# Altium schematic sheet passive_balancing.SchDoc: foxBMS BMS-Slave 12-Cell
size 350 x 299 mm; DocumentNumber: 9; SheetNumber: 9; SheetTotal: 21; AUTHOR: Fraunhofer IISB foxBMS Team; SheetDescription: Passive Cell Balancing
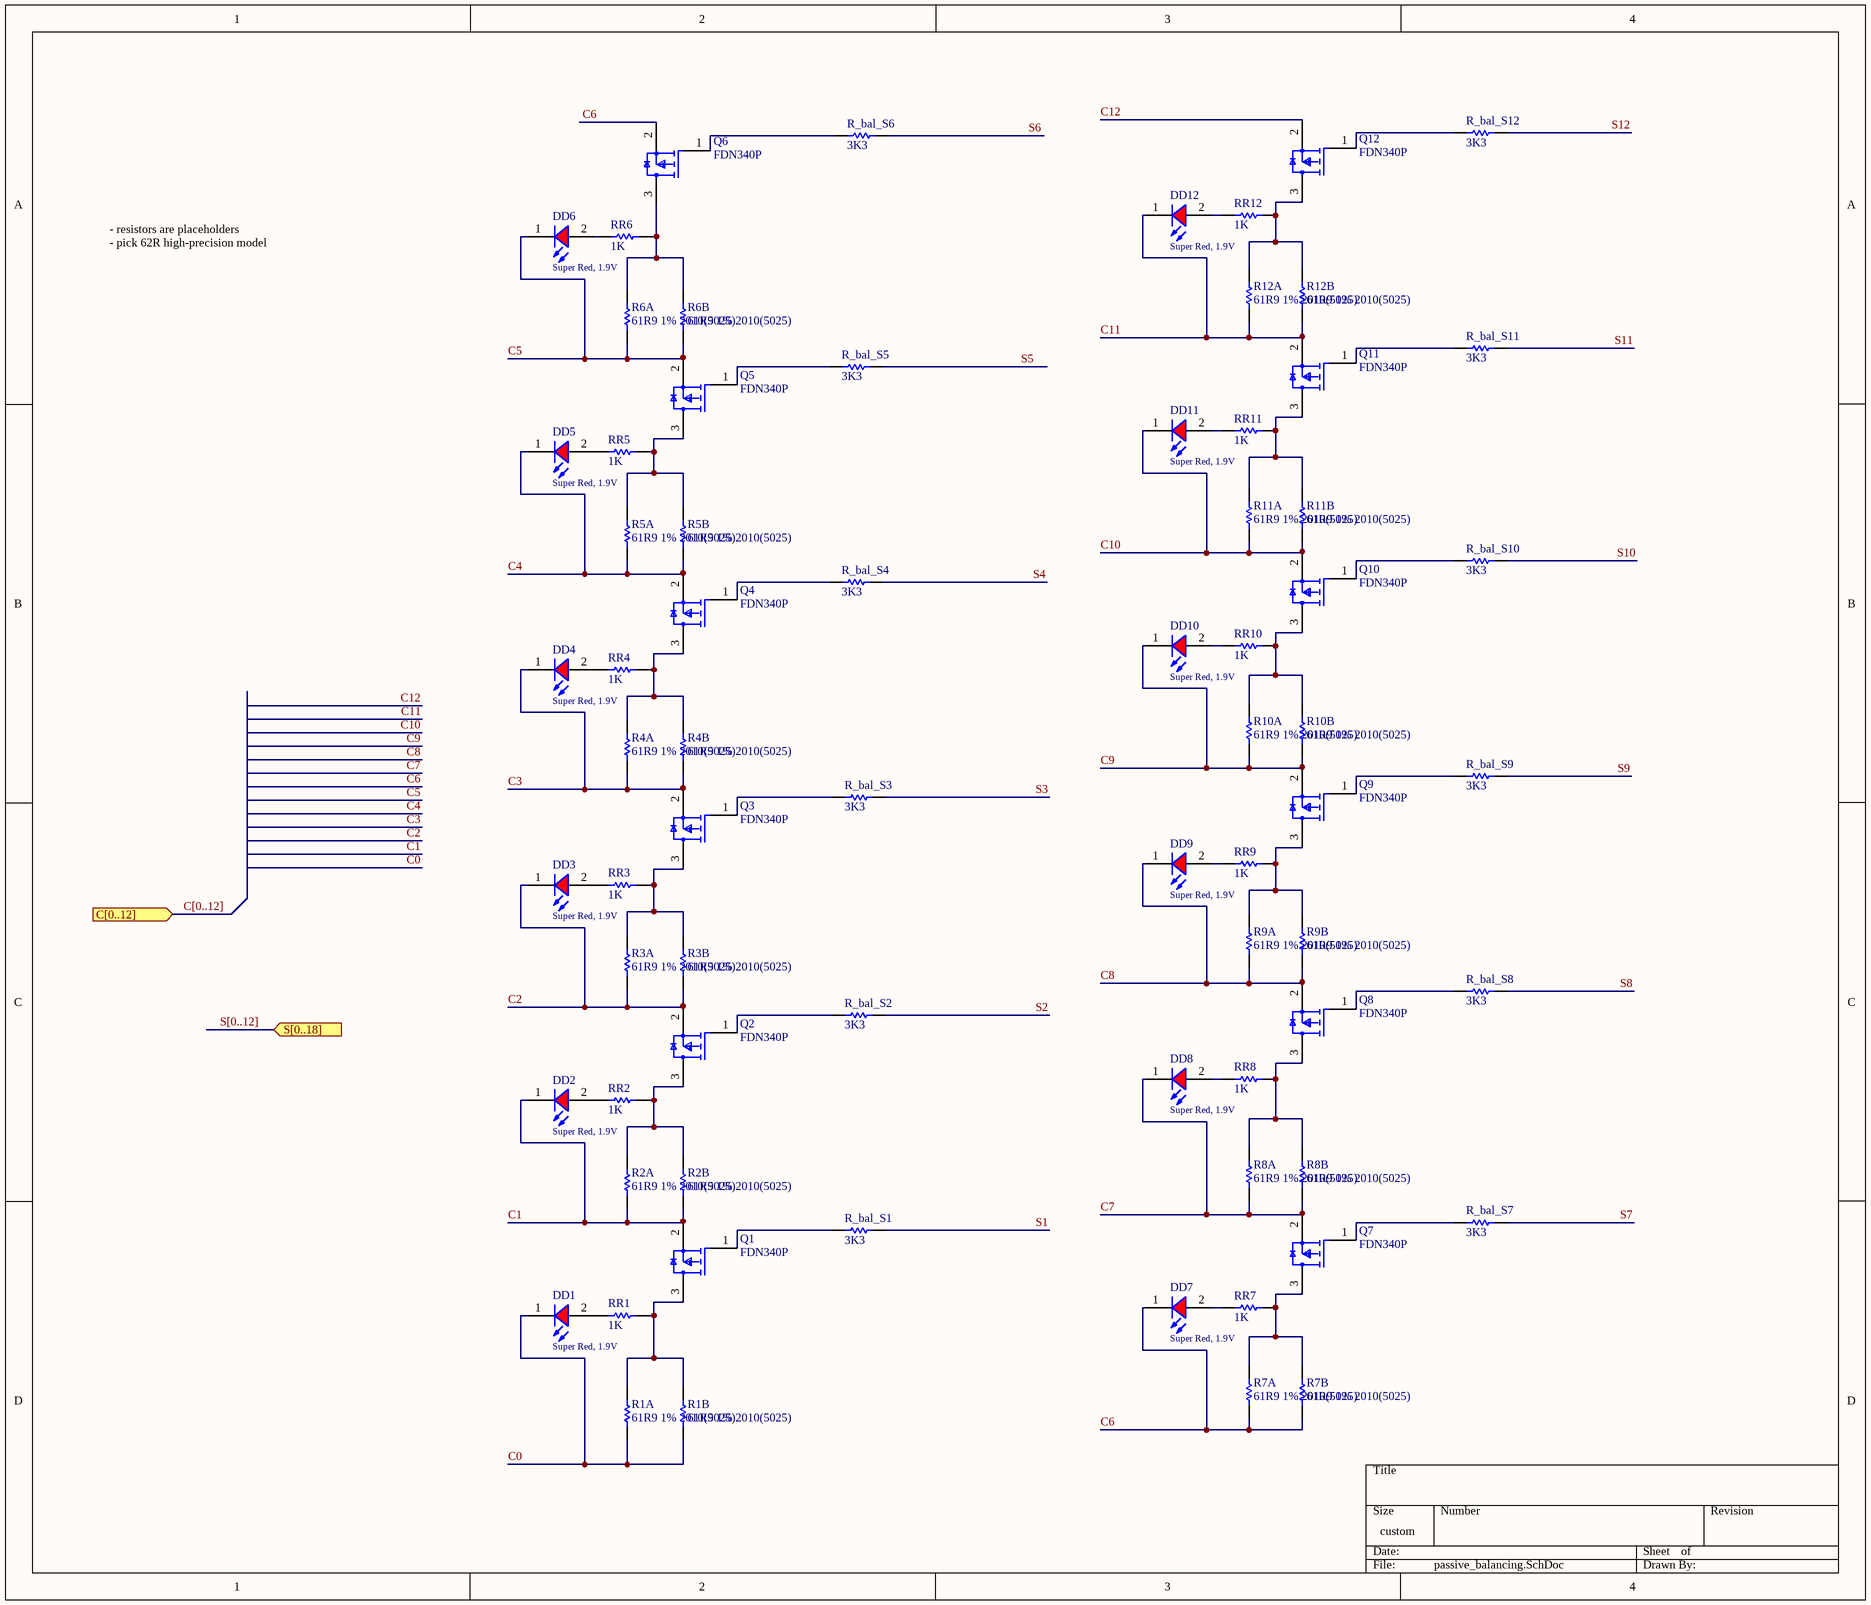
[diagram p0: passive_balancing.SchDoc]

## Parts
DD1  Super Red, 1.9V  [WL-SMCW_0603_H=0.7mm]
DD2  Super Red, 1.9V  [WL-SMCW_0603_H=0.7mm]
DD3  Super Red, 1.9V  [WL-SMCW_0603_H=0.7mm]
DD4  Super Red, 1.9V  [WL-SMCW_0603_H=0.7mm]
DD5  Super Red, 1.9V  [WL-SMCW_0603_H=0.7mm]
DD6  Super Red, 1.9V  [WL-SMCW_0603_H=0.7mm]
DD7  Super Red, 1.9V  [WL-SMCW_0603_H=0.7mm]
DD8  Super Red, 1.9V  [WL-SMCW_0603_H=0.7mm]
DD9  Super Red, 1.9V  [WL-SMCW_0603_H=0.7mm]
DD10  Super Red, 1.9V  [WL-SMCW_0603_H=0.7mm]
DD11  Super Red, 1.9V  [WL-SMCW_0603_H=0.7mm]
DD12  Super Red, 1.9V  [WL-SMCW_0603_H=0.7mm]
Q1  FDN340P  [FP-527AG-MFG]
Q2  FDN340P  [FP-527AG-MFG]
Q3  FDN340P  [FP-527AG-MFG]
Q4  FDN340P  [FP-527AG-MFG]
Q5  FDN340P  [FP-527AG-MFG]
Q6  FDN340P  [FP-527AG-MFG]
Q7  FDN340P  [FP-527AG-MFG]
Q8  FDN340P  [FP-527AG-MFG]
Q9  FDN340P  [FP-527AG-MFG]
Q10  FDN340P  [FP-527AG-MFG]
Q11  FDN340P  [FP-527AG-MFG]
Q12  FDN340P  [FP-527AG-MFG]
R1A  61R9 1% 2010(5025)  [RESC2010(5025)_M]
R1B  61R9 1% 2010(5025)  [RESC2010(5025)_M]
R2A  61R9 1% 2010(5025)  [RESC2010(5025)_M]
R2B  61R9 1% 2010(5025)  [RESC2010(5025)_M]
R3A  61R9 1% 2010(5025)  [RESC2010(5025)_M]
R3B  61R9 1% 2010(5025)  [RESC2010(5025)_M]
R4A  61R9 1% 2010(5025)  [RESC2010(5025)_M]
R4B  61R9 1% 2010(5025)  [RESC2010(5025)_M]
R5A  61R9 1% 2010(5025)  [RESC2010(5025)_M]
R5B  61R9 1% 2010(5025)  [RESC2010(5025)_M]
R6A  61R9 1% 2010(5025)  [RESC2010(5025)_M]
R6B  61R9 1% 2010(5025)  [RESC2010(5025)_M]
R7A  61R9 1% 2010(5025)  [RESC2010(5025)_M]
R7B  61R9 1% 2010(5025)  [RESC2010(5025)_M]
R8A  61R9 1% 2010(5025)  [RESC2010(5025)_M]
R8B  61R9 1% 2010(5025)  [RESC2010(5025)_M]
R9A  61R9 1% 2010(5025)  [RESC2010(5025)_M]
R9B  61R9 1% 2010(5025)  [RESC2010(5025)_M]
R10A  61R9 1% 2010(5025)  [RESC2010(5025)_M]
R10B  61R9 1% 2010(5025)  [RESC2010(5025)_M]
R11A  61R9 1% 2010(5025)  [RESC2010(5025)_M]
R11B  61R9 1% 2010(5025)  [RESC2010(5025)_M]
R12A  61R9 1% 2010(5025)  [RESC2010(5025)_M]
R12B  61R9 1% 2010(5025)  [RESC2010(5025)_M]
R_bal_S1  3K3  [RESC0603(1608)_N]
R_bal_S2  3K3  [RESC0603(1608)_N]
R_bal_S3  3K3  [RESC0603(1608)_N]
R_bal_S4  3K3  [RESC0603(1608)_N]
R_bal_S5  3K3  [RESC0603(1608)_N]
R_bal_S6  3K3  [RESC0603(1608)_N]
R_bal_S7  3K3  [RESC0603(1608)_N]
R_bal_S8  3K3  [RESC0603(1608)_N]
R_bal_S9  3K3  [RESC0603(1608)_N]
R_bal_S10  3K3  [RESC0603(1608)_N]
R_bal_S11  3K3  [RESC0603(1608)_N]
R_bal_S12  3K3  [RESC0603(1608)_N]
RR1  1K  [RESC0603(1608)_N]
RR2  1K  [RESC0603(1608)_N]
RR3  1K  [RESC0603(1608)_N]
RR4  1K  [RESC0603(1608)_N]
RR5  1K  [RESC0603(1608)_N]
RR6  1K  [RESC0603(1608)_N]
RR7  1K  [RESC0603(1608)_N]
RR8  1K  [RESC0603(1608)_N]
RR9  1K  [RESC0603(1608)_N]
RR10  1K  [RESC0603(1608)_N]
RR11  1K  [RESC0603(1608)_N]
RR12  1K  [RESC0603(1608)_N]

## Ports
C[0..12] (in), S[0..18] (in)

## Nets
C0: DD1.1(K) R1A.1 R1B.1
C1: DD2.1(K) Q1.2(S) R2A.1 R2B.1
C2: DD3.1(K) Q2.2(S) R3A.1 R3B.1
C3: DD4.1(K) Q3.2(S) R4A.1 R4B.1
C4: DD5.1(K) Q4.2(S) R5A.1 R5B.1
C5: DD6.1(K) Q5.2(S) R6A.1 R6B.1
C6: DD7.1(K) Q6.2(S) R7A.1 R7B.1
C7: DD8.1(K) Q7.2(S) R8A.1 R8B.1
C8: DD9.1(K) Q8.2(S) R9A.1 R9B.1
C9: DD10.1(K) Q9.2(S) R10A.1 R10B.1
C10: DD11.1(K) Q10.2(S) R11A.1 R11B.1
C11: DD12.1(K) Q11.2(S) R12A.1 R12B.1
C12: Q12.2(S)
S1: R_bal_S1.2
S2: R_bal_S2.2
S3: R_bal_S3.2
S4: R_bal_S4.2
S5: R_bal_S5.2
S6: R_bal_S6.2
S7: R_bal_S7.2
S8: R_bal_S8.2
S9: R_bal_S9.2
S10: R_bal_S10.2
S11: R_bal_S11.2
S12: R_bal_S12.2
NetDD1_2: DD1.2(A) RR1.2
NetDD2_2: DD2.2(A) RR2.2
NetDD3_2: DD3.2(A) RR3.2
NetDD4_2: DD4.2(A) RR4.2
NetDD5_2: DD5.2(A) RR5.2
NetDD6_2: DD6.2(A) RR6.2
NetDD7_2: DD7.2(A) RR7.2
NetDD8_2: DD8.2(A) RR8.2
NetDD9_2: DD9.2(A) RR9.2
NetDD10_2: DD10.2(A) RR10.2
NetDD11_2: DD11.2(A) RR11.2
NetDD12_2: DD12.2(A) RR12.2
NetQ1_1: Q1.1(G) R_bal_S1.1
NetQ1_3: Q1.3(D) R1A.2 R1B.2 RR1.1
NetQ2_1: Q2.1(G) R_bal_S2.1
NetQ2_3: Q2.3(D) R2A.2 R2B.2 RR2.1
NetQ3_1: Q3.1(G) R_bal_S3.1
NetQ3_3: Q3.3(D) R3A.2 R3B.2 RR3.1
NetQ4_1: Q4.1(G) R_bal_S4.1
NetQ4_3: Q4.3(D) R4A.2 R4B.2 RR4.1
NetQ5_1: Q5.1(G) R_bal_S5.1
NetQ5_3: Q5.3(D) R5A.2 R5B.2 RR5.1
NetQ6_1: Q6.1(G) R_bal_S6.1
NetQ6_3: Q6.3(D) R6A.2 R6B.2 RR6.1
NetQ7_1: Q7.1(G) R_bal_S7.1
NetQ7_3: Q7.3(D) R7A.2 R7B.2 RR7.1
NetQ8_1: Q8.1(G) R_bal_S8.1
NetQ8_3: Q8.3(D) R8A.2 R8B.2 RR8.1
NetQ9_1: Q9.1(G) R_bal_S9.1
NetQ9_3: Q9.3(D) R9A.2 R9B.2 RR9.1
NetQ10_1: Q10.1(G) R_bal_S10.1
NetQ10_3: Q10.3(D) R10A.2 R10B.2 RR10.1
NetQ11_1: Q11.1(G) R_bal_S11.1
NetQ11_3: Q11.3(D) R11A.2 R11B.2 RR11.1
NetQ12_1: Q12.1(G) R_bal_S12.1
NetQ12_3: Q12.3(D) R12A.2 R12B.2 RR12.1

## Buses and harness runs
bus C[0..12] = port C[0..12]
bus S[0..12] = port S[0..18]

## Notes on the sheet
- - resistors are placeholders
  - pick 62R high-precision model
- Fraunhofer IISB
- Schottkystr. 10
- developed by:
- 91058 Erlangen
- Germany
- Author
- Project
- License
- Description
- File
- Version
- Release Date
- Sheet
- www.foxbms.org
- www.iisb.fraunhofer.de
- foxBMS Team
- /

## Library data of the parts
DD1-DD12 = 150060SS75000: WL-SMCW SMT Mono-color Chip LED Waterclear, size 0603, Super Red, 1.9V, 140deg; Chip Technology: AlInGaP; Dominant Wavelength typ.: 630nm; Luminous Intensity typ.: 60mcd; Peak Wavelength typ.: 645nm; Viewing Angle: 140deg; ComponentLink1Description: Manufacturer; ComponentLink1URL: http://www.we-online.de; ComponentLink2URL: https://www.we-online.com/catalog/datasheet/150060SS75000.pdf; ComponentLink2Description: Datasheet; Forward Voltage typ.: 1.9V; Emitting Color: Super Red; Mounting Technology: SMT; Operating Temperature: -40 to +85degC; Published Date: December 2019; Part Number: 150060SS75000; Packaging: Tape and Reel; Size: 0603; Publisher: Wurth Elektronik
Q1-Q12 = CMP-2100-03638-2: MOSFET P-CH 20V 2A SSOT3; Fall Time: 11ns; Rise Time: 9ns; Voltage Rating (DC): -20V; Power Dissipation: 500mW; Nominal Vgs: -800mV; Current Rating: -2A; Gate to Source Voltage (Vgs): 8V; Rds On Max: 70mR; Turn-Off Delay Time: 27ns; Element Configuration: Single; Number of Elements: 1; Input Capacitance: 779pF; Drain to Source Resistance: 60mR; Turn-On Delay Time: 10ns; Package Quantity: 1; Mount: Surface Mount; Case/Package: SOT-23; Min Operating Temperature: -55°C; REACH SVHC: No SVHC; Weight: 0.03g; Packaging: Tape and Reel; Threshold Voltage: -800mV; Max Operating Temperature: 150°C; Dual Supply Voltage: -20V; Termination: SMD/SMT; Drain to Source Voltage (Vdss): 20V; Height: 0.94mm; Length: 2.92mm; Contact Plating: Tin; Width: 3.05mm; Drain to Source Breakdown Voltage: -20V; Max Power Dissipation: 500mW; Continuous Drain Current (ID): 2A; Number of Pins: 3; Lead Free: Lead Free; Radiation Hardening: No; On-State Resistance: 70MR
R1A R1B R2A R2B R3A R3B R4A R4B R5A R5B R6A R6B R7A R7B R8A R8B R9A R9B R10A R10B R11A R11B R12A R12B = CMP-1017-00374-1: 61R9 0.75W 1% 2010 (5025 Metric)  SMD; Case-Metric: 5025; Case-EIA: 2010; Value: 61.90 Ohm; Power: 0.75 W; Tolerance: 1 %; Technology: SMT
R_bal_S1-R_bal_S12 = Res 3K3: Chipwiderstand, SMD, Baureihe MC, 1%; Manufacturer: Multicomp; Power: 100mW; PackageReference: 0603; Value: 3K3; OC_FARNELL: 9331026
RR1-RR12 = Res 1K: Chipwiderstand, SMD, Baureihe MC, 1%; Manufacturer: Multicomp; Power: 100mW; PackageReference: 0603; Value: 1K; OC_FARNELL: 9330380